# Altium schematic sheet DOCKING IR-BUMPER-SENSOR.SchDoc
size A4; SheetNumber: 18; SheetTotal: 32
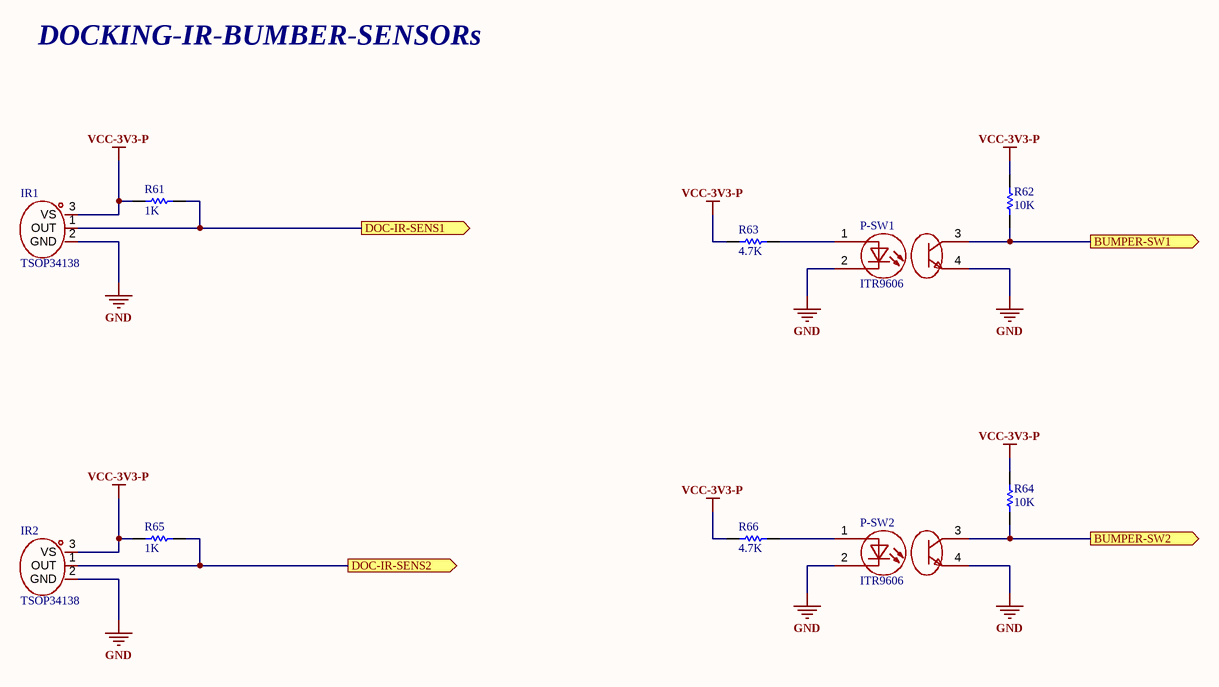
[diagram p0: DOCKING IR-BUMPER-SENSOR.SchDoc]

## Parts
IR1  TSOP34138  [SENSOR-TH_TSOP32138]
IR2  TSOP34138  [SENSOR-TH_TSOP32138]
P-SW1  ITR9606  [OPTO-TH_4P_ITR9606]
P-SW2  ITR9606  [OPTO-TH_4P_ITR9606]
R61  1K  [RES-0402]
R62  10K  [RES-0402]
R63  4.7K  [RES-0402]
R64  10K  [RES-0402]
R65  1K  [RES-0402]
R66  4.7K  [RES-0402]

## Ports
BUMPER-SW1 (out, see Controller-RK3562-TOP[6A]), BUMPER-SW2 (out, see Controller-RK3562-TOP[6A]), DOC-IR-SENS1 (out, see Controller-RK3562-TOP[6A]), DOC-IR-SENS2 (out, see Controller-RK3562-TOP[6A])

## Nets
GND: IR1.2(GND) IR2.2(GND) P-SW1.2 P-SW1.4 P-SW2.2 P-SW2.4
VCC-3V3-P: IR1.3(VS) IR2.3(VS) R61.2 R62.2 R63.2 R64.2 R65.2 R66.2
BUMPER-SW1: P-SW1.3 R62.1 ; port BUMPER-SW1
BUMPER-SW2: P-SW2.3 R64.1 ; port BUMPER-SW2
DOC-IR-SENS1: IR1.1(OUT) R61.1 ; port DOC-IR-SENS1
DOC-IR-SENS2: IR2.1(OUT) R65.1 ; port DOC-IR-SENS2
NetP-SW1_1: P-SW1.1 R63.1
NetP-SW2_1: P-SW2.1 R66.1

## Notes on the sheet
- DOCKING-IR-BUMBER-SENSORs

## Library data of the parts
IR1 IR2 = IR-RECEIVER: ManufacturingPartNumber: *; Manufacturer: *; SupplierPartNumber: *; Supplier: *; VoltageRate: *
P-SW1 P-SW2 = OPTO-IR-SW: ManufacturingPartNumber: *; Manufacturer: *; SupplierPartNumber: *; Supplier: *; VoltageRate: *
R61-R66 = Resistor-1: ManufacturingPartNumber: *; Manufacturer: *; SupplierPartNumber: *; Supplier: *; VoltageRate: *